# EAGLE design FINAL BOARD (EAGLE 7.5.0)
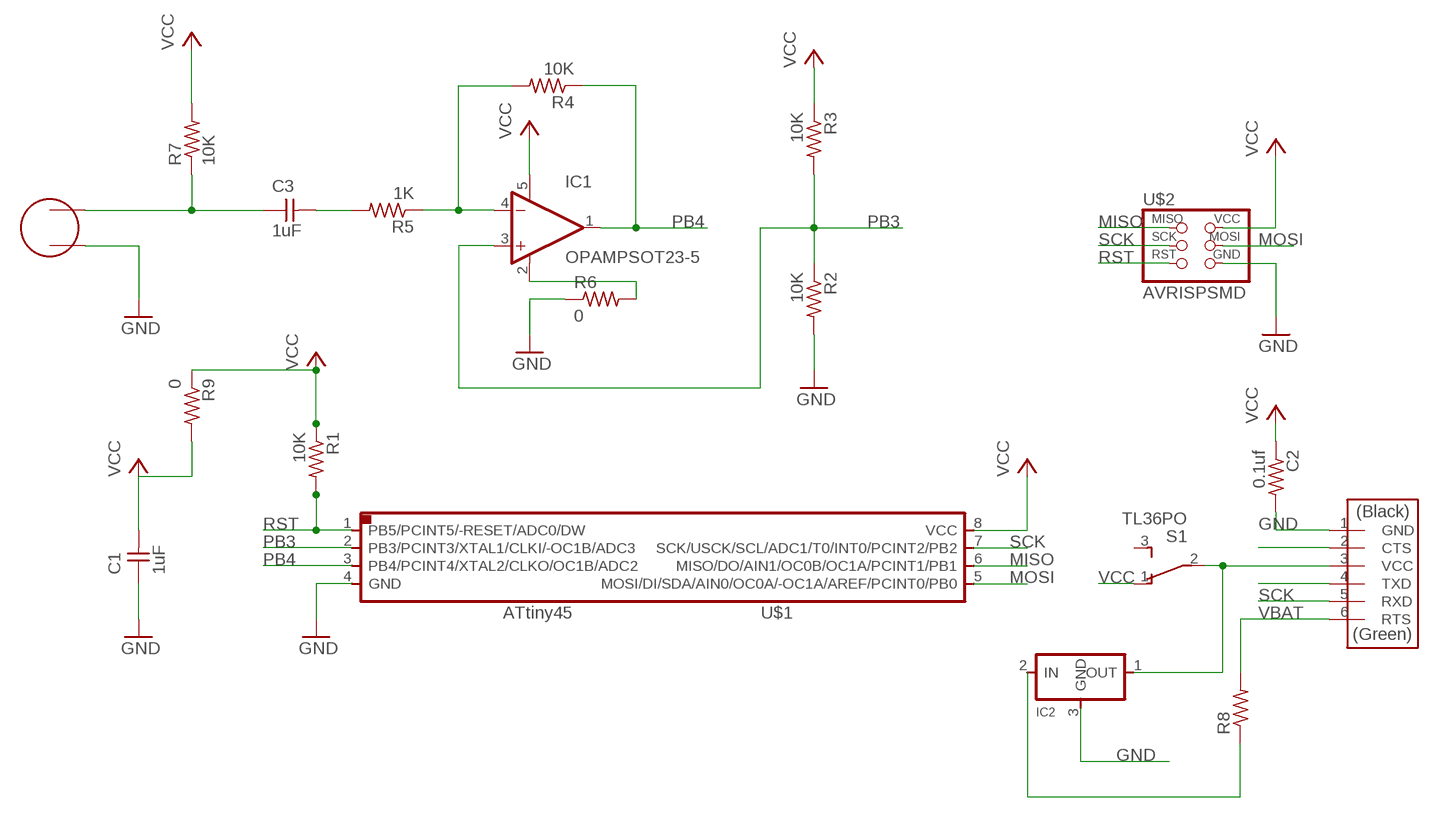
[diagram p0: schematic, sheet 1]

## Parts
C1  1uF  UNPOLARIZED_CAPACITOR1206  [1206]
C2  0.1uf  RESISTOR1206  [1206]
C3  1uF  UNPOLARIZED_CAPACITOR1206  [1206]
IC1  OPAMPSOT23-5  [SOT23-5]
IC2  REGULATORSOT23  [SOT23]
R1  10K  RESISTOR1206  [1206]
R2  10K  RESISTOR1206  [1206]
R3  10K  RESISTOR1206  [1206]
R4  10K  RESISTOR1206  [1206]
R5  1K  RESISTOR1206  [1206]
R6  0  RESISTOR1206  [1206]
R7  10K  RESISTOR1206  [1206]
R8  RES-US1206  [R1206]
R9  0  RESISTOR1206  [1206]
S1  TL36PO  [TL3XPO]
U$1  ATTINY45SI  [SOIC8]
U$2  AVRISPSMD  [2X03SMD]
U$3  FTDI-SMD-HEADER  [1X06SMD]
U$4  ELECTRET  [ELECTRET_2742PBJ-A]

## Nets
GND: C1.1 C2.2 IC2.3(GND) R2.2 R6.1 U$1.4(GND) U$2.6(GND) U$3.1(GND) U$4.P$1
MISO: U$1.6(MISO/DO/AIN1/OC0B/OC1A/PCINT1/PB1) U$2.1(MISO)
MOSI: U$1.5(MOSI/DI/SDA/AIN0/OC0A/-OC1A/AREF/PCINT0/PB0) U$2.4(MOSI)
N$1: C3.1 R7.1 U$4.P$2
N$2: C3.2 R5.2
N$3: IC1.4(-IN) R4.2 R5.1
N$5: IC1.2(V-) R6.2
N$6: U$3.2(CTS)
N$7: IC2.1(OUT) S1.2(P) U$3.3(VCC)
N$8: U$3.4(TXD)
PB3: IC1.3(+IN) R2.1 R3.2 U$1.2(PB3/PCINT3/XTAL1/CLKI/-OC1B/ADC3)
PB4: IC1.1(OUT) R4.1 U$1.3(PB4/PCINT4/XTAL2/CLKO/OC1B/ADC2)
RST: R1.2 U$1.1(PB5/PCINT5/-RESET/ADC0/DW) U$2.5(RST)
SCK: U$1.7(SCK/USCK/SCL/ADC1/T0/INT0/PCINT2/PB2) U$2.3(SCK) U$3.5(RXD)
VBAT: R8.2 U$3.6(RTS)
VBB: IC2.2(IN) R8.1
VCC: C1.2 C2.1 IC1.5(V+) R1.1 R3.1 R7.2 R9.1 R9.2 S1.1(O) U$1.8(VCC) U$2.2(VCC)
Unconnected: S1.3(S)

## Library data of the parts
C1 C3 = 01_FAB_Hello:UNPOLARIZED_CAPACITOR: unpolarized_capacitor
C2 R1-R7 R9 = 01_FAB_Hello:RESISTOR
IC1 = fab:OPAMP: Rail-to-Rail Operational Amplifiers Single-Supply, MicroAmplifier(TM) Series
IC2 = fab:REGULATOR
R8 = fab:RES-US: Resistor (US Symbol) Variants with postfix FAB are widened to allow the routing of internal traces
S1 = switch:TL36PO: TINY SWITCH ON - ON Source: http://www2.produktinfo.conrad.com/datenblaetter/700000-724999/705152-da-01-de-Subminiaturschalter_TL_36YO.pdf
U$1 = 01_fab:ATTINY45
U$2 = 01_FAB_Hello:AVRISP
U$3 = fab:FTDI-SMD-HEADER
U$4 = fab:ELECTRET

## Board
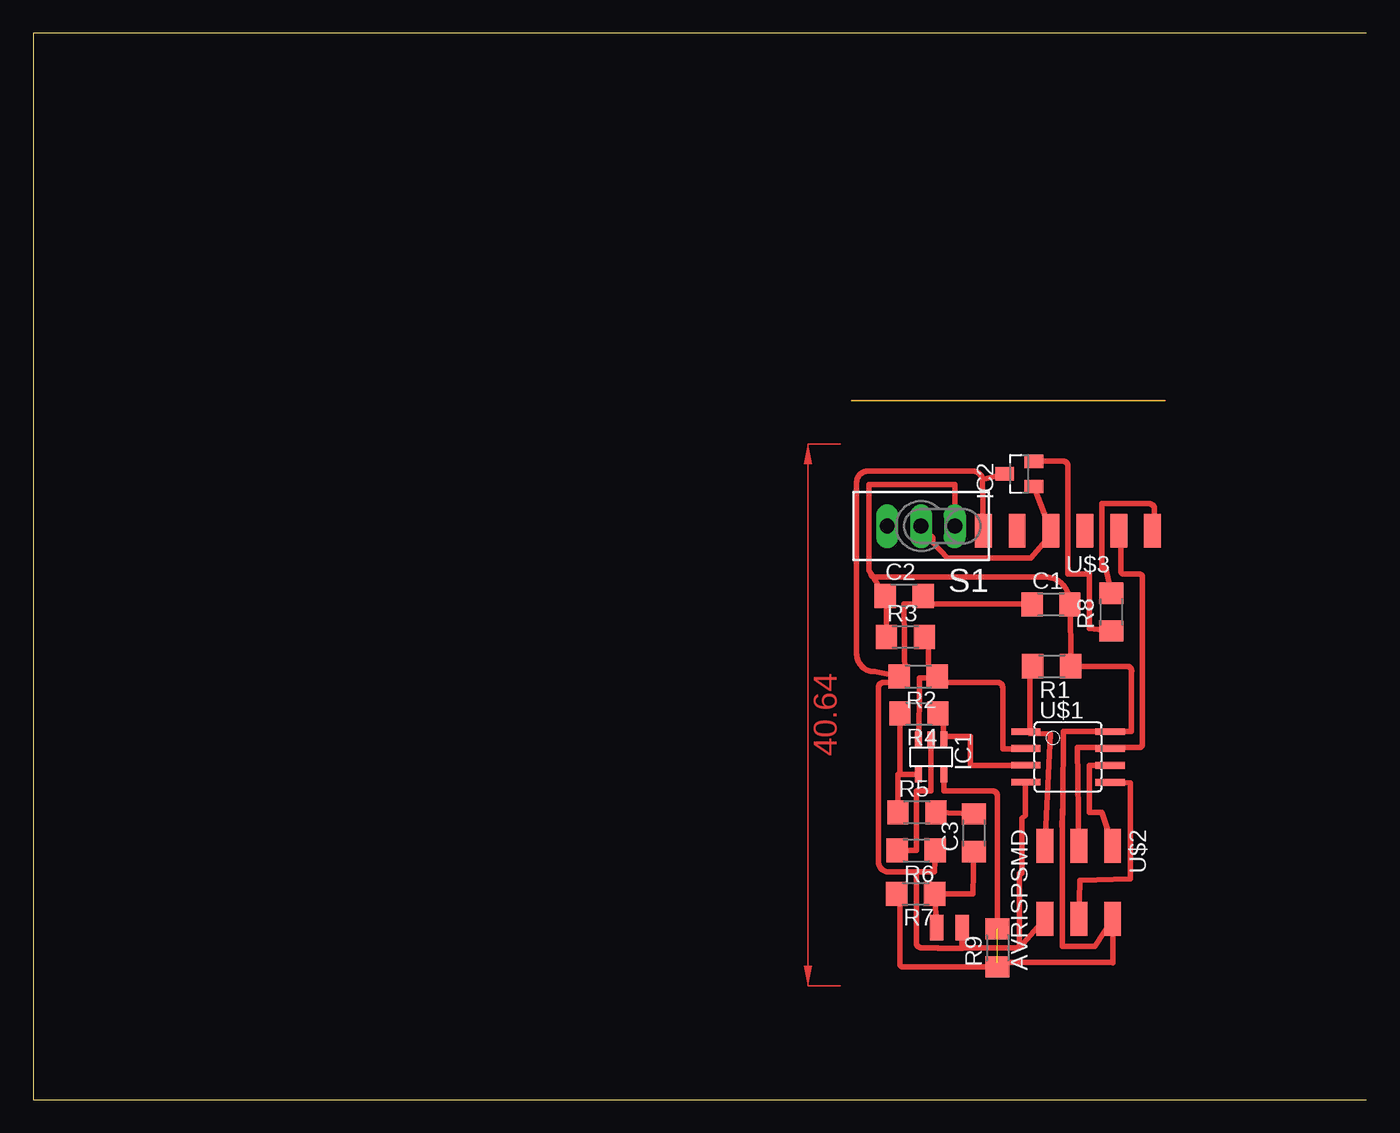
[diagram p1: board, top side]

Size 100 x 80 mm. Coordinates in mm from the lower left corner, seen from the top.
Outline: 100,0 0,0 0,80 100,80
Copper layers (1*16): Top 0.035mm / dielectric 1.5mm / Bottom 0.035mm
Design rules "default *": minimum track width 10mil, minimum drill 24mil, track to track 11mil, track to pad 11mil, pad to pad 11mil, via to via 11mil, smd to smd 11mil, copper to edge 40mil, drill to drill 8mil, minimum pad ring 10mil, minimum via ring 8mil, stop-mask expansion 4mil, vias tented up to drill 0mil, thermal gap 10mil

### Footprints (pad centres in the part's own frame; a part is rotated, then mirrored left to right if it is on the bottom)
1206 = smd 1.6 x 1.803: 1 -1.422,0; 2 1.422,0
SOT23-5 = smd 0.533 x 1.194: 1 -0.95,-1.306; 2 0,-1.306; 3 0.95,-1.306; 4 0.95,1.306; 5 -0.95,1.306
SOT23 = smd 1 x 1.4: 1 -0.95,-1.1; 2 0.95,-1.1; 3 0,1.1
R1206 = smd 1.6 x 1.803: 1 -1.422,0; 2 1.422,0
TL3XPO = drill 1.1 pad 1.422 long: 1 -2.54,0; 2 0,0; 3 2.54,0
SOIC8 = smd 0.5 x 2.2: 1 -1.905,-3.154; 2 -0.645,-3.154; 3 0.625,-3.154; 4 1.895,-3.154; 5 1.905,3.154; 6 0.635,3.154; 7 -0.635,3.154; 8 -1.905,3.154
2X03SMD = smd 2.54 x 1.27: 1 -2.54,2.54; 2 2.92,2.54; 3 -2.54,0; 4 2.92,0; 5 -2.54,-2.54; 6 2.92,-2.54
1X06SMD = smd 2.54 x 1.27: 1 0,6.35; 2 0,3.81; 3 0,1.27; 4 0,-1.27; 5 0,-3.81; 6 0,-6.35
ELECTRET_2742PBJ-A = smd 1.016 x 1.905: P$1 -0.953,0; P$2 0.953,0

### Placement (x,y rotation side)
C1  76.35,37.13 0 top
C2  65.33,37.8 0 top
C3  70.56,20.02 90 top
IC1  67.36,25.7 180 top
IC2  73.96,46.94 90 top
R1  76.4,32.51 180 top
R2  66.4,31.75 180 top
R3  65.43,34.7 0 top
R4  66.45,28.96 180 top
R5  66.29,21.54 0 top
R6  66.24,18.69 180 top
R7  66.19,15.44 180 top
R8  80.87,36.58 90 top
R9  72.34,11.38 90 top
S1  66.6,43.03 180 top
U$1  77.62,25.7 270 top
U$2  78.44,16.48 270 top
U$3  77.62,42.67 90 top
U$4  68.73,12.9 180 top

### Tracks (layer width: path | path; a pad name or v marks a point on that pad's centre or on a via)
GND
  Top 0.254: 74.75,37.19 C1.1 | 74.42,23.65 U$1.4 | 65.18,31.45 65.38,31.34 R2.2 | 66.83,37.52 67.16,37.19 C2.2 66.83,37.52
  Top 0.406: 73.97,11.38 69.69,11.38 U$4.P$1 69.7,11.35 67.89,11.35 arc-90 67.87,11.38 66.65,11.38 arc-90 66.24,11.79 66.24,17.07 | 74.75,37.19 67.16,37.19 65.33,37.19 65.38,31.34 | R6.1 67.59,17.07 66.24,17.07 | 74.42,23.65 74.42,21.34 74.17,21.08 74.17,16.97 73.97,16.97 73.97,11.38 | 73.97,11.38 U$2.6 | 71.22,46.53 IC2.3 | R2.2 63.09,32.11 arc-90 61.77,33.43 61.77,46.33 arc-90 62.59,47.14 70.31,47.14 arc-90 71.22,46.53 | U$3.1 71.22,46.53 | 65.18,31.45 arc-90 65.02,31.29 63.8,31.29 arc90 63.4,30.89 63.4,17.88 arc90 64.21,17.07 66.24,17.07
MISO
  Top 0.406: U$2.1 80.16,21.54 79.25,21.54 79.25,25.07 U$1.6
MOSI
  Top 0.406: U$1.5 82.3,23.77 82.3,16.56 78.54,16.46 U$2.4
N$1
  Top 0.406: U$4.P$2 R7.1 70.51,15.44 C3.1
N$2
  Top 0.406: C3.2 R5.2
N$3
  Top 0.406: R5.1 64.87,24.4 IC1.4 66.41,24.38 65.02,24.38 R4.2 | R4.2
N$5
  Top 0.406: R6.2 66.24,18.69 66.24,23.16 67.36,23.16 IC1.2
N$7
  Top 0.254: 76.4,42.47 U$3.3
  Top 0.406: S1.2 67.49,42.14 67.49,41.81 68.58,40.62 74.85,40.62 76.4,42.47 | IC2.1 U$3.3
N$10  (1 unrouted)
PB3
  Top 0.254: 67.74,31.65 R2.1 | 67.16,32.56 68.15,31.57 R2.1 | 67.16,34.54 R3.2 | 73.43,26.29 74.42,26.29 U$1.2 | 68.48,31.24 R2.1
  Top 0.406: 67.74,31.65 66.5,31.62 66.5,29.72 IC1.3 | 67.16,32.56 67.16,34.54 | 73.43,26.29 72.73,26.31 | 72.73,26.31 72.95,26.31 | 68.48,31.24 arc-90 68.53,31.29 72.34,31.29 arc-90 72.73,30.9 72.73,26.31
PB4
  Top 0.406: R4.1 67.87,28.85 68.28,28.85 68.28,27.01 IC1.1 68.31,27.23 70.31,27.23 70.31,25.08 U$1.3
RST
  Top 0.254: 74.75,27.46 74.75,27.61 U$1.1 | 74.75,32.23 R1.2
  Top 0.406: 74.75,27.61 74.75,32.23 | U$2.5 76.3,27.43 74.75,27.46
SCK
  Top 0.406: U$1.7 80.78,26.42 | 80.78,26.42 78.33,26.42 U$2.3 78.44,18.41 | 80.78,26.42 83.01,26.42 arc90 83.21,26.72 83.21,39.12 arc90 83.01,39.42 81.89,39.42 arc-90 81.59,39.62 81.59,43.18 | 81.69,43.48 81.59,43.18 | 81.59,43.18 U$3.5
VBAT
  Top 0.406: R8.2 80.47,39.83 80.16,39.83 80.16,44.7 83.72,44.7 arc-90 84.12,44.3 84.12,42.67 U$3.6
VBB
  Top 0.406: R8.1 79.25,35.36 79.25,39.42 77.62,39.42 77.62,47.55 arc90 77.28,47.89 IC2.2
VCC  (1 unrouted)
  Top 0.254: 77.72,37.19 C1.2
  Top 0.406: R3.1 64.01,37.8 C2.1 62.84,39.47 | 62.84,39.47 62.69,39.7 62.69,41.6 62.69,43.33 62.69,46.13 69.14,46.13 S1.1 | C1.2 77.83,34.29 R1.1 82.09,32.51 arc-90 82.4,32.11 82.4,27.61 U$1.8 77.27,27.61 77.25,22.28 | 77.17,20.5 77.25,22.28 | IC1.5 68.31,23.16 71.93,23.16 arc-90 72.34,22.76 R9.2 | 77.25,22.28 77.22,20.32 77.22,11.48 79.65,11.48 U$2.2 80.97,10.26 80.7,10.29 72.34,10.29 R9.1 65.23,9.96 arc-90 65.02,10.16 65.02,15.19 arc90 R7.2 | 77.72,37.19 77.72,37.39 arc90 75.89,39.22 63.09,39.22 arc-90 62.84,39.47
(copper drawn outside any net)
  shapes: Top area x2